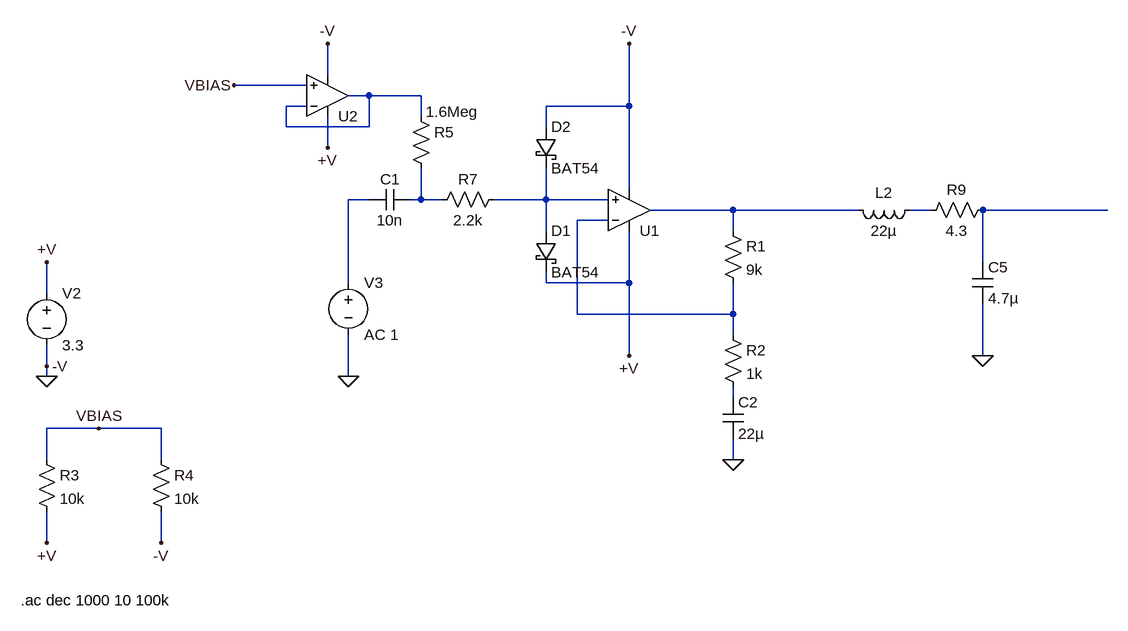
[diagram p0: schematic AFE_frequency_response.asc]
AFE_frequency_response.asc, the LTspice schematic file:
Version 4.1
SHEET 1 1756 1092
WIRE -272 -48 -272 -96
WIRE -304 -32 -416 -32
WIRE -208 -16 -240 -16
WIRE -128 -16 -208 -16
WIRE -304 0 -336 0
WIRE 192 0 192 -96
WIRE 192 0 64 0
WIRE -128 16 -128 -16
WIRE -336 32 -336 0
WIRE -208 32 -208 -16
WIRE -208 32 -336 32
WIRE 64 32 64 0
WIRE -272 64 -272 16
WIRE 192 128 192 0
WIRE -208 144 -240 144
WIRE -128 144 -128 96
WIRE -128 144 -144 144
WIRE -96 144 -128 144
WIRE 64 144 64 96
WIRE 64 144 -16 144
WIRE 160 144 64 144
WIRE 352 160 224 160
WIRE 544 160 352 160
WIRE 656 160 624 160
WIRE 928 160 736 160
WIRE 160 176 112 176
WIRE 64 192 64 144
WIRE 352 192 352 160
WIRE 736 240 736 160
WIRE -240 272 -240 144
WIRE 64 272 64 256
WIRE 192 272 192 192
WIRE 192 272 64 272
WIRE -704 288 -704 240
WIRE 112 320 112 176
WIRE 352 320 352 272
WIRE 352 320 112 320
WIRE 352 352 352 320
WIRE 192 384 192 272
WIRE 736 384 736 304
WIRE -704 400 -704 368
WIRE -704 416 -704 400
WIRE -240 416 -240 352
WIRE 352 448 352 432
WIRE -624 496 -704 496
WIRE -528 496 -624 496
WIRE -704 544 -704 496
WIRE -528 544 -528 496
WIRE 352 544 352 512
WIRE -704 672 -704 624
WIRE -528 672 -528 624
FLAG -704 416 0
FLAG -704 400 -V
FLAG -704 240 +V
FLAG 192 -96 -V
FLAG 192 384 +V
FLAG 352 544 0
FLAG -528 672 -V
FLAG -624 496 VBIAS
FLAG -272 -96 -V
FLAG -272 64 +V
FLAG -416 -32 VBIAS
FLAG -704 672 +V
FLAG -240 416 0
FLAG 736 384 0
SYMBOL voltage -704 272 R0
SYMATTR InstName V2
SYMATTR Value 3.3
SYMBOL res 336 176 R0
SYMATTR InstName R1
SYMATTR Value 9k
SYMBOL res 336 336 R0
SYMATTR InstName R2
SYMATTR Value 1k
SYMBOL cap 336 448 R0
SYMATTR InstName C2
SYMATTR Value 22µ
SYMBOL OpAmps\\UniversalOpAmp2 192 160 M180
SYMATTR InstName U1
SYMATTR Value2 Avol=713k GBW=10Meg Slew=7Meg
SYMBOL cap -144 128 R90
WINDOW 0 0 32 VBottom 2
WINDOW 3 32 32 VTop 2
SYMATTR InstName C1
SYMATTR Value 10n
SYMBOL res -720 528 R0
SYMATTR InstName R3
SYMATTR Value 10k
SYMBOL res -544 528 R0
SYMATTR InstName R4
SYMATTR Value 10k
SYMBOL OpAmps\\UniversalOpAmp2 -272 -16 M180
SYMATTR InstName U2
SYMATTR Value2 Avol=713k GBW=10Meg Slew=7Meg
SYMBOL res -144 0 R0
WINDOW 3 23 9 Left 2
SYMATTR Value 1.6Meg
SYMATTR InstName R5
SYMBOL schottky 48 192 R0
SYMATTR InstName D1
SYMATTR Value BAT54
SYMATTR Description Diode
SYMATTR Type diode
SYMBOL schottky 48 32 R0
SYMATTR InstName D2
SYMATTR Value BAT54
SYMATTR Description Diode
SYMATTR Type diode
SYMBOL res 0 128 R90
WINDOW 0 0 56 VBottom 2
WINDOW 3 32 56 VTop 2
SYMATTR InstName R7
SYMATTR Value 2.2k
SYMBOL voltage -240 256 R0
WINDOW 123 24 124 Left 2
WINDOW 39 0 0 Left 0
SYMATTR InstName V3
SYMATTR Value AC 1
SYMBOL ind 640 144 R90
WINDOW 0 5 56 VBottom 2
WINDOW 3 32 56 VTop 2
SYMATTR InstName L2
SYMATTR Value 22µ
SYMATTR SpiceLine Rser=1m
SYMBOL cap 720 240 R0
SYMATTR InstName C5
SYMATTR Value 4.7µ
SYMBOL res 752 144 R90
WINDOW 0 0 56 VBottom 2
WINDOW 3 32 56 VTop 2
SYMATTR InstName R9
SYMATTR Value 4.3
TEXT -744 760 Left 2 !.ac dec 1000 10 100k

The netlist it stands for:
* AFE_frequency_response.asc
V2 +V 0 3.3
R1 N005 N008 9k
R2 N008 N009 1k
C2 N009 0 22µ
X§U1 N004 N008 +V 0 N005 level2 Avol=713k GBW=10Meg Slew=7Meg Ilimit=25m Rail=0 Vos=0 En=0 Enk=0 In=0 Ink=0 Rin=500Meg  ; pins In+ In- V+ V- OUT
C1 N003 N002 10n
R3 VBIAS +V 10k
R4 VBIAS 0 10k
X§U2 VBIAS N001 +V 0 N001 level2 Avol=713k GBW=10Meg Slew=7Meg Ilimit=25m Rail=0 Vos=0 En=0 Enk=0 In=0 Ink=0 Rin=500Meg  ; pins In+ In- V+ V- OUT
R5 N001 N003 1.6Meg
D1 N004 +V BAT54
D2 0 N004 BAT54
R7 N004 N003 2.2k
V3 N002 0 AC 1
L2 N006 N005 22µ Rser=1m
C5 N007 0 4.7µ
R9 N007 N006 4.3
.model D D
.lib standard.dio
.ac dec 1000 10 100k
.lib UniversalOpAmp2.lib
.backanno
.end